# EAGLE design zzh (EAGLE 9.6.1)
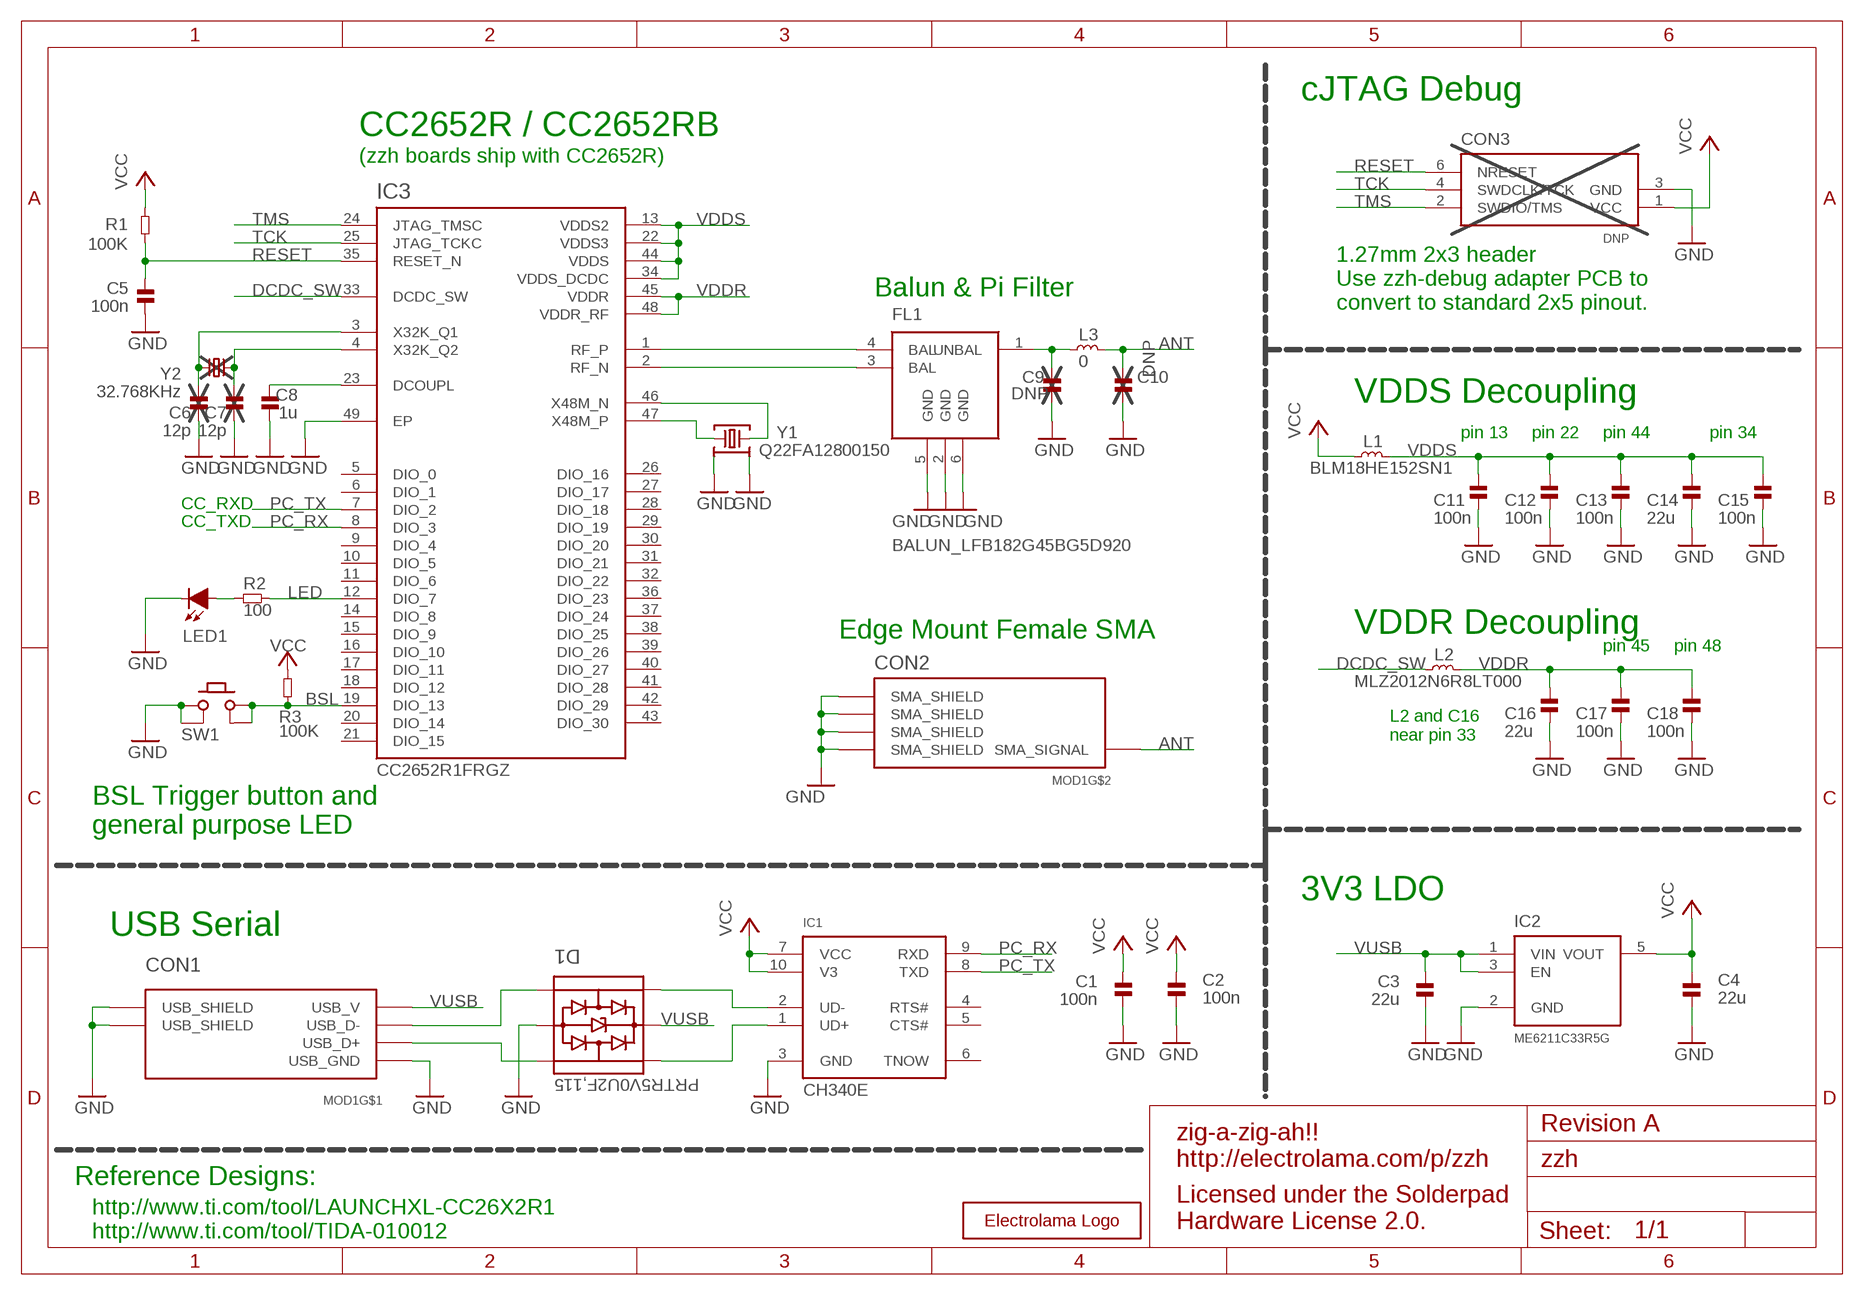
[diagram p0: schematic, sheet 1]

## Parts
C1  100n  CAP-0402  [_PKG_C_0402]
C2  100n  CAP-0402  [_PKG_C_0402]
C3  22u  CAP-0805  [_PKG_C_0805]
C4  22u  CAP-0805  [_PKG_C_0805]
C5  100n  CAP-0402  [_PKG_C_0402]
C6  12p  CAP-0402  [_PKG_C_0402]
C7  12p  CAP-0402  [_PKG_C_0402]
C8  1u  CAP-0402  [_PKG_C_0402]
C9  DNP  CAP-0402  [_PKG_C_0402]
C10  DNP  CAP-0402  [_PKG_C_0402]
C11  100n  CAP-0402  [_PKG_C_0402]
C12  100n  CAP-0402  [_PKG_C_0402]
C13  100n  CAP-0402  [_PKG_C_0402]
C14  22u  CAP-0805  [_PKG_C_0805]
C15  100n  CAP-0402  [_PKG_C_0402]
C16  22u  CAP-0805  [_PKG_C_0805]
C17  100n  CAP-0402  [_PKG_C_0402]
C18  100n  CAP-0402  [_PKG_C_0402]
CON3  DNP  DEBUG_CORTEX-SWD/CJTAG-5PIN-CUT5  [DEBUG_CORTEX_5PIN]
D1  PRTR5V0U2F,115  DIODE-TVS-PRTR5V0U2F"  [_PKG_SOT886_JEDEC-MO-252]
FL1  BALUN_LFB182G45BG5D920  [LFB182G45BG5D920]
IC1  CH340E  INTERFACE-CH340E  [_PKG_MSOP10_TI-DGS10]
IC2  ME6211C33R5G  POWER-LDO-ME6211C33R5G  [SOT65P212X110-5N]
IC3  CC2652R1FRGZ  WMCU-CC2652R1FRGZ  [QFN50P700X700X100-49N]
L1  BLM18HE152SN1  INDUCTOR-0603  [_PKG_L_0603]
L2  MLZ2012N6R8LT000  INDUCTOR-0805  [_PKG_C_0805]
L3  0  INDUCTOR-0402  [_PKG_L_0402]
LED1  LED-0603  [_PKG_LED_0603]
MOD1  ZZH_MODULE  [ZZH_MODULE]
R1  100K  RES-0402  [_PKG_C_0402]
R2  100  RES-0402  [_PKG_C_0402]
R3  100K  RES-0402  [_PKG_C_0402]
SW1  K2-1177SW-D4DW-06  PUSHBUTTON-K2-1177SW-D4DW-06  [K2-1177SW-D4DW-06]
U$5  LOGO-ELECTROLAMA  [ELECTROLAMA]
Y1  Q22FA12800150  48.000MHZ_CX2016DB48000C0FPLC1  [XTAL-4P-2016]
Y2  32.768KHz  32.768KHZ_Q13FC1350000400  [XTAL-2P-3215]

## Nets
ANT: C10.2 L3.2 MOD1.SMA_SIGNAL
BSL: IC3.19(DIO_13) R3.2 SW1.3(2_1) SW1.4(2_2)
DCDC_SW: IC3.33(DCDC_SW) L2.1
DCOUPL: C8.2 IC3.23(DCOUPL)
GND: C1.1 C2.1 C3.2 C4.2 C5.1 C6.1 C7.1 C8.1 C9.1 C10.1 C11.2 C12.2 C13.2 C14.2 C15.2 C16.2 C17.2 C18.2 CON3.3(GND) D1.2 FL1.2(GND) FL1.5(GND) FL1.6(GND) IC1.3(GND) IC2.2(GND) IC3.49(EP) LED1.C MOD1.SMA_SHIELD_1(SMA_SHIELD) MOD1.SMA_SHIELD_2(SMA_SHIELD) MOD1.SMA_SHIELD_3(SMA_SHIELD) MOD1.SMA_SHIELD_4(SMA_SHIELD) MOD1.USB_GND MOD1.USB_SHIELD_1(USB_SHIELD) MOD1.USB_SHIELD_2(USB_SHIELD) SW1.1(1_1) SW1.2(1_2) Y1.2 Y1.4
LED: IC3.12(DIO_7) R2.1
N$16: LED1.A R2.2
PC_RX: IC1.9(RXD) IC3.8(DIO_3)
PC_TX: IC1.8(TXD) IC3.7(DIO_2)
RESET: C5.2 CON3.6(NRESET) IC3.35(RESET_N) R1.1
RF_N: FL1.3(BAL) IC3.2(RF_N)
RF_P: FL1.4(BAL) IC3.1(RF_P)
TCK: CON3.4(SWDCLK/TCK) IC3.25(JTAG_TCKC)
TMS: CON3.2(SWDIO/TMS) IC3.24(JTAG_TMSC)
UD+: D1.6 IC1.1(UD+)
UD-: D1.4 IC1.2(UD-)
UNBAL: C9.2 FL1.1(UNBAL) L3.1
USB_D+: D1.1 MOD1.USB_D+
USB_D-: D1.3 MOD1.USB_D-
VCC: C1.2 C2.2 C4.1 CON3.1(VCC) IC1.7(VCC) IC1.10(V3) IC2.5(VOUT) L1.1 R1.2 R3.1
VDDR: C16.1 C17.1 C18.1 IC3.45(VDDR) IC3.48(VDDR_RF) L2.2
VDDS: C11.1 C12.1 C13.1 C14.1 C15.1 IC3.13(VDDS2) IC3.22(VDDS3) IC3.34(VDDS_DCDC) IC3.44(VDDS) L1.2
VUSB: C3.1 D1.5 IC2.1(VIN) IC2.3(EN) MOD1.USB_V
X32K_Q1: C6.2 IC3.3(X32K_Q1) Y2.1
X32K_Q2: C7.2 IC3.4(X32K_Q2) Y2.2
X48M_N: IC3.46(X48M_N) Y1.3
X48M_P: IC3.47(X48M_P) Y1.1
Unconnected: IC1.4(RTS#) IC1.5(CTS#) IC1.6(TNOW) IC3.5(DIO_0) IC3.6(DIO_1) IC3.9(DIO_4) IC3.10(DIO_5) IC3.11(DIO_6) IC3.14(DIO_8) IC3.15(DIO_9) IC3.16(DIO_10) IC3.17(DIO_11) IC3.18(DIO_12) IC3.20(DIO_14) IC3.21(DIO_15) IC3.26(DIO_16) IC3.27(DIO_17) IC3.28(DIO_18) IC3.29(DIO_19) IC3.30(DIO_20) IC3.31(DIO_21) IC3.32(DIO_22) IC3.36(DIO_23) IC3.37(DIO_24) IC3.38(DIO_25) IC3.39(DIO_26) IC3.40(DIO_27) IC3.41(DIO_28) IC3.42(DIO_29) IC3.43(DIO_30)

## Notes on the sheet
- cJTAG Debug
- CC2652R / CC2652RB
- (zzh boards ship with CC2652R)
- Balun & Pi Filter
- 1.27mm 2x3 header
  Use zzh-debug adapter PCB to
  convert to standard 2x5 pinout.
- VDDS Decoupling
- pin 13 | pin 22 | pin 44 | pin 34
- CC_RXD
- CC_TXD
- Edge Mount Female SMA | VDDR Decoupling
- pin 45 | pin 48
- CON2
- L2 and C16
  near pin 33
- BSL Trigger button and
  general purpose LED
- 3V3 LDO
- USB Serial
- CON1
- Revision A
- zig-a-zig-ah!!
  http://electrolama.com/p/zzh
- Reference Designs:
- Licensed under the Solderpad
  Hardware License 2.0.
- http://www.ti.com/tool/LAUNCHXL-CC26X2R1
  http://www.ti.com/tool/TIDA-010012

## Library data of the parts
C1-C18 = ok-discretes-dev:CAP
CON3 = ok-testdebug-dev:DEBUG_CORTEX-SWD/CJTAG-5PIN
D1 = ok-discretes-dev:DIODE-TVS-PRTR5V0U2F: ESD Suppressor, NXP, PRTR5V0U2F Source: Datasheet <https://assets.nexperia.com/documents/data-sheet/PRTR5V0U2F_PRTR5V0U2K.pdf>; DESCRIPTION: ESD Suppressor, NXP, PRTR5V0U2F; HEIGHT: 0.5mm; MANUFACTURER_NAME: Nexperia; MANUFACTURER_PART_NUMBER: PRTR5V0U2F,115; MOUSER_PART_NUMBER: 771-PRTR5V0U2F-T/R; MOUSER_PRICE-STOCK: https://www.mouser.com/Search/Refine.aspx?Keyword=771-PRTR5V0U2F-T%2FR; RS_PART_NUMBER: 8166931P; RS_PRICE-STOCK: http://uk.rs-online.com/web/p/products/8166931P
FL1 = ok-rf-dev:BALUN_LFB182G45BG5D920: Balance Matching BAND PASS FILTER Source: Datasheet <http://www.murata.com/en-us/api/pdfdownloadapi?cate=luLCBalancedFilter&partno=LFB182G45BG5D920>; DESCRIPTION: Balance Matching BAND PASS FILTER; HEIGHT: mm; MANUFACTURER_NAME: Murata Electronics; MANUFACTURER_PART_NUMBER: LFB182G45BG5D920; MOUSER_PART_NUMBER: 81-LFB182G45BG5D920; MOUSER_PRICE-STOCK: https://www.mouser.com/Search/Refine.aspx?Keyword=81-LFB182G45BG5D920
IC1 = ok-chips-dev:INTERFACE-CH340E
IC2 = ok-chips-dev:POWER-LDO-ME6211C33R5G
IC3 = ok-chips-dev:WMCU-CC2652R1FRGZ: Texas Instruments SimpleLink? Multi-Standard CC2652R Wireless MCU 48-VQFN -40 to 85 Source: Datasheet <http://www.ti.com/lit/ds/symlink/cc2652r.pdf>; DESCRIPTION: Texas Instruments SimpleLink? Multi-Standard CC2652R Wireless MCU 48-VQFN -40 to 85; HEIGHT: 1mm; MANUFACTURER_NAME: Texas Instruments; MANUFACTURER_PART_NUMBER: CC2652R1FRGZT; MOUSER_PART_NUMBER: 595-CC2652R1FRGZT; MOUSER_PRICE-STOCK: https://www.mouser.com/Search/Refine.aspx?Keyword=595-CC2652R1FRGZT
L1-L3 = ok-discretes-dev:INDUCTOR
LED1 = ok-opto-dev:LED
MOD1 = ok-modules-dev:ZZH_MODULE
R1-R3 = ok-discretes-dev:RES
SW1 = ok-electromech-dev:PUSHBUTTON-K2-1177SW-D4DW-06
U$5 = ok-logos-dev:LOGO-ELECTROLAMA
Y1 = ok-xtal-osc-dev:48.000MHZ_CX2016DB48000C0FPLC1: 48MHz ±10ppm Crystal 7pF 50 Ohms 4-SMD, No Lead Datasheet <https://media.digikey.com/pdf/Data%20Sheets/Kyocera%20International/CX2016DB48000C0FPLC1_DS.pdf>; DIGIKEY_PART: 1253-2042-1-ND; MFG_NAME: KYOCERA; MFG_PART: CX2016DB48000C0FPLC1
Y2 = ok-xtal-osc-dev:32.768KHZ_Q13FC1350000400: SMD Crystal Resonators 32.768KHz +/-20ppm SMD-3215_2P RoHS Datasheet <https://datasheet.lcsc.com/szlcsc/1901081604_Seiko-Epson-Q13FC1350000400_C32346.pdf>; LCSC_PART: C32346; MFG_NAME: SEIKO EPSON; MFG_PART: Q13FC1350000400

## Board
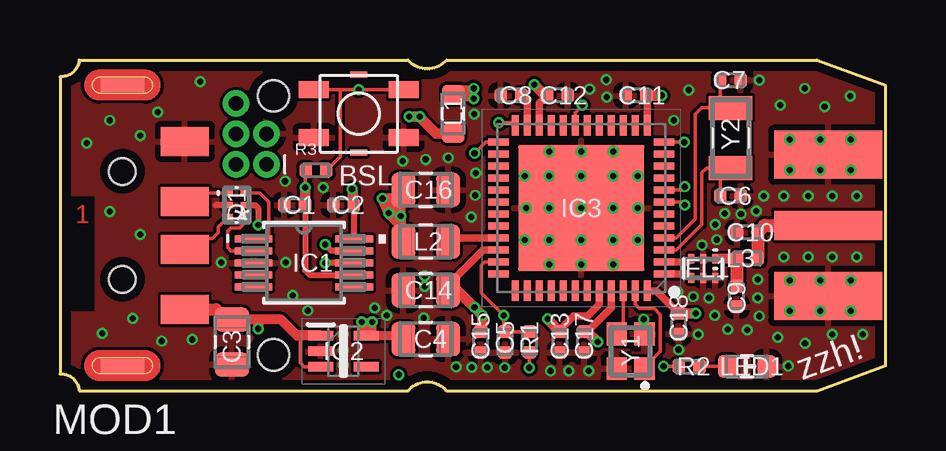
[diagram p1: board, top side]
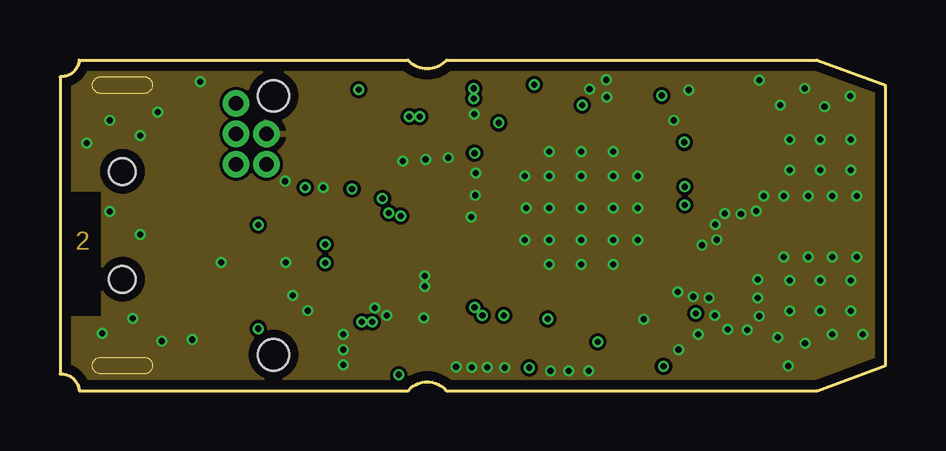
[diagram p2: board, inner layer Route2]
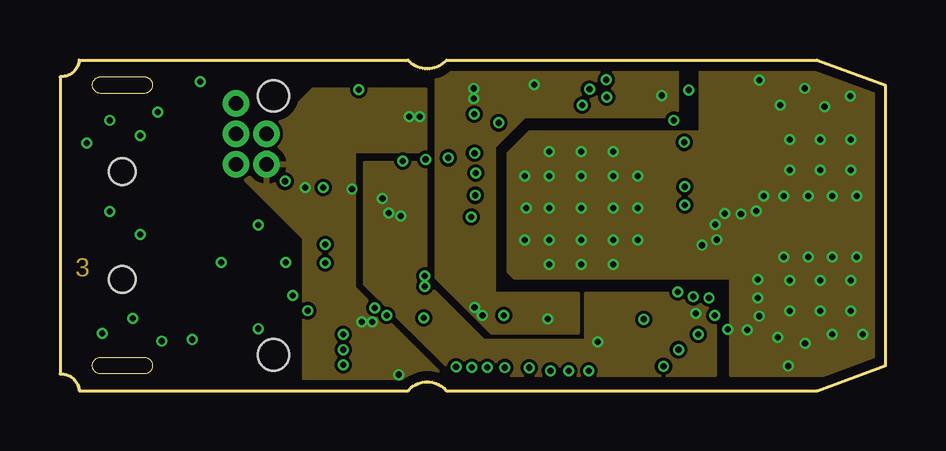
[diagram p3: board, inner layer Route15]
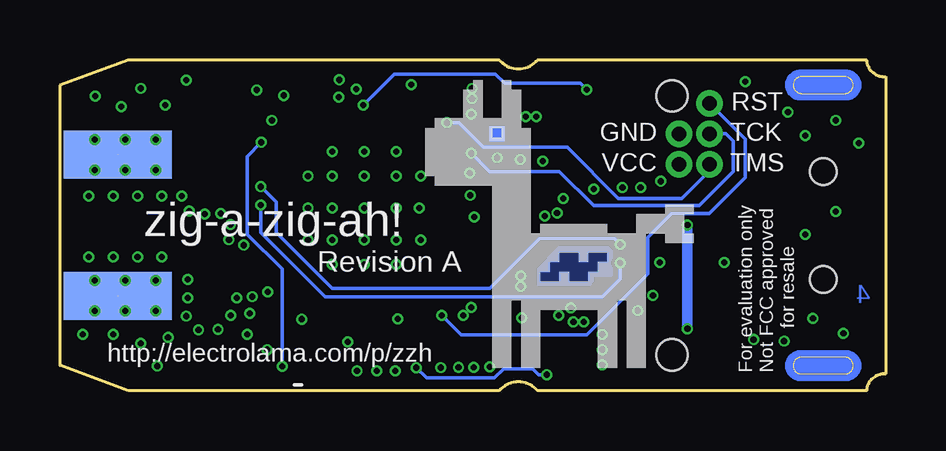
[diagram p4: board, bottom side, seen from below]

Size 34.4 x 13.8 mm. Coordinates in mm from the lower left corner, seen from the top.
Copper layers (1*2*15*16): Top 0.035559375mm / dielectric 0.17018125mm / Route2 0.01778125mm / dielectric 47mil / Route15 0.01778125mm / dielectric 0.17018125mm / Bottom 0.035559375mm
Design rules "oshpark-4layer *": minimum track width 5mil, minimum drill 10mil, track to track 5mil, track to pad 5mil, pad to pad 5mil, via to via 5mil, smd to smd 5mil, copper to edge 15mil, drill to drill 6mil, minimum pad ring 4mil, minimum via ring 4mil, stop-mask expansion 2.5mil, vias tented up to drill 50mil, thermal gap 10mil
tRestrict: area 0.3,3.3 to 1.4,8.1; area 27.1,9.9 to 28.8,11.2
bRestrict: area 0.3,3.3 to 1.4,8.1

### Footprints (pad centres in the part's own frame; a part is rotated, then mirrored left to right if it is on the bottom)
_PKG_C_0402 = smd 0.54 x 0.6: 1 -0.43,0; 2 0.43,0
_PKG_C_0805 = smd 1 x 1.42: 1 -0.935,0; 2 0.935,0
DEBUG_CORTEX_5PIN = drill 0.6 pad 1.108: 1 -1.27,-0.635; 2 -1.27,0.635; 3 0,-0.635; 4 0,0.635; 6 1.27,0.635
_PKG_SOT886_JEDEC-MO-252 = smd 0.25 x 0.325: 1 -0.5,-0.337; 2 0,-0.337; 3 0.5,-0.337; 4 0.5,0.337; 5 0,0.337; 6 -0.5,0.337
LFB182G45BG5D920 = smd 0.25 x 0.4: 1 0.5,0.4; 2 0,0.4; 3 -0.5,0.4; 4 -0.5,-0.4; 5 0,-0.4; 6 0.5,-0.4
_PKG_MSOP10_TI-DGS10 = smd 1.575 x 0.279: 1 -2.095,1; 2 -2.095,0.5; 3 -2.095,0; 4 -2.095,-0.5; 5 -2.095,-1; 6 2.095,-1; 7 2.095,-0.5; 8 2.095,0; 9 2.095,0.5; 10 2.095,1
SOT65P212X110-5N = smd 1.05 x 0.4: 1 -0.95,0.65; 2 -0.95,0; 3 -0.95,-0.65; 4 0.95,-0.65; 5 0.95,0.65
QFN50P700X700X100-49N = smd 0.85 x 0.3: 1 -3.45,2.75; 2 -3.45,2.25; 3 -3.45,1.75; 4 -3.45,1.25; 5 -3.45,0.75; 6 -3.45,0.25; 7 -3.45,-0.25; 8 -3.45,-0.75; 9 -3.45,-1.25; 10 -3.45,-1.75; 11 -3.45,-2.25; 12 -3.45,-2.75; 25 3.45,-2.75; 26 3.45,-2.25; 27 3.45,-1.75; 28 3.45,-1.25; 29 3.45,-0.75; 30 3.45,-0.25; 31 3.45,0.25; 32 3.45,0.75; 33 3.45,1.25; 34 3.45,1.75; 35 3.45,2.25; 36 3.45,2.75 | smd 0.3 x 0.85: 13 -2.75,-3.45; 14 -2.25,-3.45; 15 -1.75,-3.45; 16 -1.25,-3.45; 17 -0.75,-3.45; 18 -0.25,-3.45; 19 0.25,-3.45; 20 0.75,-3.45; 21 1.25,-3.45; 22 1.75,-3.45; 23 2.25,-3.45; 24 2.75,-3.45; 37 2.75,3.45; 38 2.25,3.45; 39 1.75,3.45; 40 1.25,3.45; 41 0.75,3.45; 42 0.25,3.45; 43 -0.25,3.45; 44 -0.75,3.45; 45 -1.25,3.45; 46 -1.75,3.45; 47 -2.25,3.45; 48 -2.75,3.45 | smd 5.25 x 5.25: 49 0,0
_PKG_L_0603 = smd 0.79 x 0.93: 1 -0.82,0; 2 0.82,0
_PKG_L_0402 = smd 0.54 x 0.6: 1 -0.43,0; 2 0.43,0
_PKG_LED_0603 = smd 0.79 x 0.93: A 0.82,0; C -0.82,0
ZZH_MODULE = smd 4.5 x 2: SMA_SHIELD_1 32,9.85; SMA_SHIELD_2 32,3.95 | smd 4.5 x 2 bottom: SMA_SHIELD_3 32,9.85; SMA_SHIELD_4 32,3.95 | smd 4.5 x 1.2: SMA_SIGNAL 32,6.9 | smd 2 x 1.2: USB_D+ 5.2,7.9; USB_D- 5.2,5.9; USB_GND 5.2,10.4; USB_V 5.2,3.4 | smd 1.8 x 0.7: USB_SHIELD_1 2.6,12.75; USB_SHIELD_2 2.6,1.05 | hole 1.1: 2.6,9.15; 2.6,4.65 | hole 1.3: 8.9,12.3; 8.9,1.5
K2-1177SW-D4DW-06 = smd 1.25 x 0.7: 1 -1.875,1; 2 1.875,1; 3 -1.875,-1; 4 1.875,-1 | smd 0.7 x 0.25: M1 0,1.625; M2 0,-1.625
XTAL-4P-2016 = smd 0.95 x 0.85: 1 -0.725,-0.575; 2 0.725,-0.575; 3 0.725,0.575; 4 -0.725,0.575
XTAL-2P-3215 = smd 1 x 1.8: 1 -1.25,0; 2 1.25,0

### Placement (x,y rotation side)
C1  9.78,7.75 0 top
C2  11.81,7.75 0 top
C3  7.16,2.03 270 top
C4  15.24,2.16 0 top
C5  18.54,2.03 90 top
C6  27.94,8.13 180 top
C7  27.94,12.95 180 top
C8  18.8,12.32 0 top
C9  28.19,3.94 90 top
C10  28.64,6.6 0 top
C11  24,12.32 180 top
C12  20.73,12.32 0 top
C13  20.83,2.03 270 top
C14  15.24,4.19 180 top
C15  17.53,2.03 270 top
C16  15.24,8.38 0 top
C17  21.84,2.03 270 top
C18  25.78,2.79 270 top
CON3  7.98,10.72 90 top
D1  7.37,7.75 270 top
FL1  26.8,5.11 0 top
IC1  10.16,5.33 0 top
IC2  11.81,1.65 0 top
IC3  21.72,7.62 180 top
L1  16.38,11.56 90 top
L2  15.24,6.22 180 top
L3  28.64,5.52 0 top
LED1  28.63,1.02 180 top
MOD1  0,0 0 top
R1  19.56,2.03 270 top
R2  26.21,1.02 0 top
R3  10.67,9.19 0 top
SW1  12.45,11.56 180 top
U$5  13.17,5.52 0 bottom
Y1  23.77,1.65 90 top
Y2  27.94,10.54 90 top

### Tracks (layer width: path | path; a pad name or v marks a point on that pad's centre or on a via)
ANT
  Top 0.533: L3.2 C10.2 29.36,6.9 MOD1.SMA_SIGNAL
BSL  (via drill 0.25 pad 0.46)
  Top 0.152: SW1.3 v12.45,12.56 11.68,12.56 | 11.68,12.56 SW1.4 | IC3.19 21.47,11.61 v21.77,11.91 | R3.2 11.68,9.78 11.68,12.56
  Bottom 0.152: v21.77,11.91 20.47,13.21 16.26,13.21 15.88,12.83 12.72,12.83 v12.45,12.56
DCDC_SW
  Top 0.305: IC3.33 16.32,6.37 L2.1
DCOUPL
  Top 0.305: IC3.23 19.47,12.08 C8.2
GND  (via drill 0.25 pad 0.46)  (2 unrouted)
  Top 0.152: MOD1.USB_SHIELD_1
  Top 0.254: D1.2 6.48,7.75
  other vias: 20.38,9.97 21.72,9.97 23.05,9.97 24.07,8.95 19.37,8.95 19.43,7.62 19.37,6.29 20.38,5.27 21.72,5.27 23.05,5.27 24.07,6.29 23.05,8.95 21.72,7.62 20.38,8.95 21.72,8.95 24.07,7.62 24.32,2.99 17.16,0.98 11.8,2.35 11.8,1.72 11.8,1.08 6.72,5.35 9.41,5.35 17.26,11.55 22.06,12.59 22.79,12.24 29.14,12.96 29.01,7.49 26.75,6.07 27.3,6.94 27.7,7.39 27.04,3.87 25.75,4.12 27.82,2.55 30.34,1.03 26.6,2.35 20.44,0.83 22.03,0.83 18.53,0.97 16.5,0.99 13.11,3.46 15.15,3.04 16.18,9.72 17.33,9.08 17.14,7.24 23.05,7.62 23.05,6.29 21.72,6.29 20.38,6.29 20.38,7.62 5.85,12.89 4.07,11.62 3.34,10.64 30.41,10.48 31.68,10.48 32.95,10.48 32.95,9.21 31.68,9.21 30.41,9.21 30.41,4.6 30.41,3.33 31.68,3.33 32.95,3.33 31.68,4.6 32.95,4.6 32.93,12.29 31.03,12.61 30.01,11.91 3.34,6.52 2.07,11.28 3.03,3.02 4.23,2.07 1.76,2.39 2.07,7.47 1.12,10.33 27.28,3.15 26.2,12.55 25.57,11.28 9.69,3.98 10.33,3.34 5.5,2.13 26.38,3.93 27.36,6.3 30.15,8.13 31.17,8.13 32.19,8.13 33.2,8.13 33.2,5.59 32.19,5.59 31.17,5.59 30.15,5.59 33.46,2.35 32.19,2.35 31.04,1.97 29.9,2.22 28.63,2.54 29.07,4.64 29.14,3.11 29.33,8.13 28.38,7.37 29.07,3.87 17.8,0.98 21.2,0.83 17.3,8.15 22.76,12.97 15.23,9.65 14.28,9.59 13.62,3.14 15.21,4.79 15.21,4.34 9.38,8.74 10.96,8.48 31.86,11.85 25.77,1.72
  pour Top: -1.27,15.24 -1.27,-1.27 35.56,-1.27 35.56,15.24
  pour Route15: 18.67,9.91 18.67,4.95 18.92,4.7 27.94,4.7 27.94,0.64 34.92,0.64 34.92,13.34 26.67,13.34 26.67,10.79 19.56,10.79
  pour Route2: 35.56,15.88 -1.27,15.88 -1.27,8.38 1.78,8.38 1.78,3.05 -1.27,3.05 -1.27,-0.76 35.56,-0.76
LED  (via drill 0.25 pad 0.46)
  Top 0.152: R2.1 v25.15,1.02 | v26.01,10.36 IC3.12
  Bottom 0.152: v26.01,10.36 26.59,9.78 26.59,6.53 25.15,5.08 v25.15,1.02
N$2
  pour Bottom: 14.48,5.08 14.48,4.45 12.32,4.45 12.19,4.57 12.19,4.83 11.43,4.83 11.43,5.84 11.56,5.97 13.59,5.97
N$16
  Top 0.152: R2.2 LED1.A
PC_RX  (via drill 0.25 pad 0.46)
  Top 0.152: IC3.8 25.9,8.37 v26.04,8.51
  Top 0.254: IC1.9 11.31,5.83 v11.05,6.1
  Bottom 0.152: v26.04,8.51 25.4,7.87 25.4,6.6 23.06,4.27 16.5,4.27 14.41,6.35 11.3,6.35 v11.05,6.1
PC_TX  (via drill 0.25 pad 0.46)
  Top 0.152: IC3.7 25.91,7.87 v26.04,7.75
  Top 0.254: IC1.8 v11.05,5.33
  Bottom 0.152: v26.04,7.75 26.04,6.6 23.34,3.91 11.81,3.91 11.05,4.67 v11.05,5.33
RESET  (via drill 0.25 pad 0.46)
  Top 0.152: IC3.35 17.69,5.37 17.55,5.23 17.55,4.09 v18.49,3.15 18.49,2.51 C5.2 R1.1
  Bottom 0.152: v18.49,3.15 17.68,2.34 12.45,2.34 9.91,4.88 9.91,6.4 8.91,7.39 7.34,7.39 5.84,8.89 5.84,10.49 CON3.6
RF_N
  Top 0.254: 26.16,5.37 FL1.3
  Top 0.305: IC3.2 26.16,5.37
RF_P
  Top 0.254: 26.13,4.87 FL1.4
  Top 0.305: IC3.1 26.13,4.87
TCK  (via drill 0.25 pad 0.46)
  Top 0.152: IC3.25 17.74,10.37 v17.27,9.91
  Bottom 0.152: v17.27,9.91 16.51,9.14 13.59,9.14 12.17,7.72 7.77,7.72 6.35,9.14 6.35,10.41 6.66,10.72 CON3.4
TMS  (via drill 0.25 pad 0.46)
  Top 0.152: v18.29,11.18 18.86,11.18 IC3.24
  Bottom 0.152: v18.29,11.18 17.78,11.18 16.76,10.16 13.27,10.16 11.14,8.03 8.48,8.03 7.34,9.17 CON3.2
UD+
  Top 0.152: D1.6 8.33,8.25 8.7,7.87 8.7,6.41 8.62,6.33 IC1.1
UD-
  Top 0.152: D1.4 7.7,7 7.49,6.79 7.11,6.79 6.99,6.67 6.99,5.97 7.12,5.83 IC1.2
UNBAL
  Top 0.152: L3.1 28.19,5.51 | FL1.1 27.4,5.51
  Top 0.406: 27.4,5.51 28.19,5.51
  Top 0.533: 28.19,5.51 C9.2
USB_D+
  Top 0.152: D1.1 5.55,8.25 MOD1.USB_D+
USB_D-
  Top 0.152: MOD1.USB_D- 5.65,6.35 6.35,6.35 6.6,6.6 6.6,6.82 D1.3
VCC  (via drill 0.25 pad 0.46)
  Top 0.152: R1.2 v19.56,0.96 | v10.21,8.48 10.21,9.17 R3.1
  Top 0.254: C1.2 10.21,5.03 10.41,4.83 IC1.7 | C2.2 12.24,6.35 IC1.10
  Top 0.305: v14.99,11.43 v14.99,11.42
  Top 0.381: IC2.5 14.16,2.3 C4.1 14.3,1.9 14.55,1.65 | IC2.5 12.98,2.3 12.98,2.85 v13.01,2.87 | v12.57,2.87 12.62,2.82 12.62,2.39 12.53,2.3 IC2.5 | IC2.5
  Top 0.432: v14.99,11.42 15.67,10.74 L1.1 | C2.2 12.19,7.8 12.19,8.38 v12.17,8.41 | v14.55,11.43 v14.99,11.43 | C1.2 v10.21,8.48
  Bottom 0.152: v19.56,0.96 19.13,0.53 16.3,0.53 16.3,0.54 15.92,0.91 14.7,0.91 14.46,0.67 v14.12,0.67
  pour Route15: 15.24,12.57 15.24,9.97 12.26,9.97 12.26,4.32 16.07,0.51 10.16,0.51 10.16,6.35 7.62,8.89 7.62,11.43 9.4,11.43 10.54,12.57
VDDR  (via drill 0.25 pad 0.46)
  Top 0.152: 14.35,8.43 C16.1 14.3,8.03
  Top 0.305: 14.35,8.43 C16.1 | 14.32,8.37 C16.1 | C16.1 14,8.08 | L2.2 14.3,6.43 14.15,6.58 | IC3.45 22.97,3.46 21.97,2.46 C17.1 21.98,2.46 | v26.49,3.22 v26.49,3.23 | IC3.48 24.84,4.17 C18.1
  Top 0.406: 14.15,6.94 14.15,6.58 14.16,6.57 14.2,6.6 v14.2,7.29 14.2,7.92 | 13.68,7.41 v13.69,7.42 v13.44,8.02
  Top 0.432: 14.15,6.94 13.68,7.41 | 21.98,2.46 v22.4,2.03 | C18.1 v26.49,3.22 | 14.32,8.37 13.97,8.02 v13.44,8.02
  Top 0.483: v13.69,7.42 14.2,7.92 14.3,8.03
  pour Route15: 21.91,4.06 21.91,2.1 17.65,2.1 15.24,4.51 15.24,9.53 12.7,9.53 12.7,4.45 16.51,0.64 27.3,0.64 27.3,4.06
VDDS  (via drill 0.25 pad 0.46)
  Top 0.152: 16.53,12.23 L1.2
  Top 0.254: 16.18,4.42 C14.1 | v17.27,3.48
  Top 0.305: IC3.22 19.97,11.99 C12.1 20.22,12.32 | 16.57,12.56 L1.2 | IC3.13 24.47,12.29 C11.1 | IC3.34 17.63,5.87 16.18,4.42 | C14.1 16.56,4.19 | 17.6,2.54 C15.1 | IC3.44 22.47,3.6 21.98,3.11 21.41,3.11 20.83,2.53 C13.1 | 20.32,2.97 v20.32,3
  Top 0.33: v17.23,12.61 17.18,12.56 16.57,12.56 | v17.23,12.18 17.18,12.23 16.53,12.23
  Top 0.432: C11.1 v25.07,12.32 | 20.22,12.32 v19.76,12.78 | v17.27,3.48 16.56,4.19 | 17.6,2.54 v17.6,3.15 v17.27,3.48 | C13.1 20.32,2.97
  pour Route15: 21.59,2.41 17.97,2.41 15.68,4.7 15.68,13.34 25.72,13.34 25.72,11.43 19.37,11.43 18.1,10.16 18.1,4.06 21.59,4.06
VUSB  (via drill 0.25 pad 0.46)
  Top 0.152: IC2.3 10.18,1 10.01,1.17 10.01,2.3
  Top 0.254: D1.5 8.13,7.75 8.26,7.62 v8.26,6.92
  Top 0.406: IC2.1 10.01,2.3 9.87,2.3 9.2,2.97 8.26,2.97 C3.1
  Top 0.432: v8.26,2.59 8.26,2.97
  Top 0.508: MOD1.USB_V 6.51,3.4 6.94,2.97 C3.1
  Bottom 0.432: v8.26,6.92 v8.26,2.59
X32K_Q1
  Top 0.152: IC3.3 25.68,5.87 26.75,6.93 26.75,9.09 26.94,9.29 27.56,9.29 | Y2.1 27.56,9.29 | C6.2 27.51,9.24 27.56,9.29
X32K_Q2
  Top 0.152: IC3.4 25.67,6.37 26.47,7.16 26.47,11.53 26.75,11.81 27.56,11.81 | 27.56,11.81 27.92,11.81 Y2.2 | C7.2 27.51,11.86 27.56,11.81
X48M_N
  Top 0.152: IC3.46 23.47,2.64 Y1.3
X48M_P
  Top 0.152: IC3.47 23.97,3.59 24.13,3.43 24.77,3.43 25.02,3.17 25.02,1.65 24.35,0.98 Y1.1
(copper drawn outside any net)
  shapes: Bottom area x1

### Text on the board
Top: 1
Route2: 2
Route15: 3
Bottom: 4
tPlace: BSL | zzh!
bPlace: RST | TCK | GND | TMS | VCC
bNames: zig-a-zig-ah! | Revision A | For evaluation only / Not FCC approved / for resale | http://electrolama.com/p/zzh